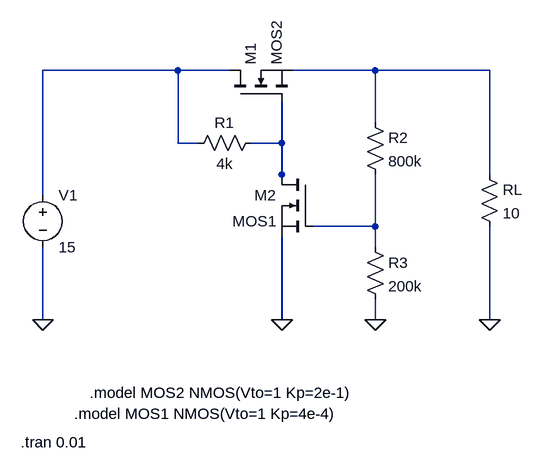
[diagram p0: schematic PROVA - P3_FET_2019_Questao_01_Fonte_Tensao_Regulada.asc]
PROVA - P3_FET_2019_Questao_01_Fonte_Tensao_Regulada.asc, the LTspice schematic file:
Version 4
SHEET 1 1032 716
WIRE 32 128 -176 128
WIRE 112 128 32 128
WIRE 336 128 208 128
WIRE 512 128 336 128
WIRE 336 208 336 128
WIRE 32 240 32 128
WIRE 64 240 32 240
WIRE 192 240 192 176
WIRE 192 240 144 240
WIRE 192 288 192 240
WIRE 512 288 512 128
WIRE 192 304 192 288
WIRE -176 320 -176 128
WIRE 336 368 336 288
WIRE 336 368 240 368
WIRE 336 400 336 368
WIRE -176 512 -176 400
WIRE 192 512 192 384
WIRE 336 512 336 480
WIRE 512 512 512 368
FLAG 192 512 0
FLAG 336 512 0
FLAG -176 512 0
FLAG 512 512 0
SYMBOL nmos 112 176 R270
SYMATTR InstName M1
SYMATTR Value MOS2
SYMBOL nmos 240 288 M0
SYMATTR InstName M2
SYMATTR Value MOS1
SYMBOL res 160 224 R90
WINDOW 0 0 56 VBottom 2
WINDOW 3 32 56 VTop 2
SYMATTR InstName R1
SYMATTR Value 4k
SYMBOL res 320 192 R0
SYMATTR InstName R2
SYMATTR Value 800k
SYMBOL voltage -176 304 R0
WINDOW 123 0 0 Left 0
WINDOW 39 0 0 Left 0
SYMATTR InstName V1
SYMATTR Value 15
SYMBOL res 496 272 R0
SYMATTR InstName RL
SYMATTR Value 10
SYMBOL res 320 384 R0
SYMATTR InstName R3
SYMATTR Value 200k
TEXT -210 700 Left 2 !.tran 0.01
TEXT -128 656 Left 2 !.model MOS1 NMOS(Vto=1 Kp=4e-4)
TEXT -104 624 Left 2 !.model MOS2 NMOS(Vto=1 Kp=2e-1)

The netlist it stands for:
* PROVA - P3_FET_2019_Questao_01_Fonte_Tensao_Regulada.asc
M1 N001 N003 N002 N002 MOS2
M2 N003 N004 0 0 MOS1
R1 N003 N001 4k
R2 N002 N004 800k
V1 N001 0 15
RL N002 0 10
R3 N004 0 200k
.model NMOS NMOS
.model PMOS PMOS
.lib standard.mos
.tran 0.01
.model MOS1 NMOS(Vto=1 Kp=4e-4)
.model MOS2 NMOS(Vto=1 Kp=2e-1)
.backanno
.end